# Altium schematic sheet Power_Supply.SchDoc
size A4; SheetNumber: 2; SheetTotal: 6
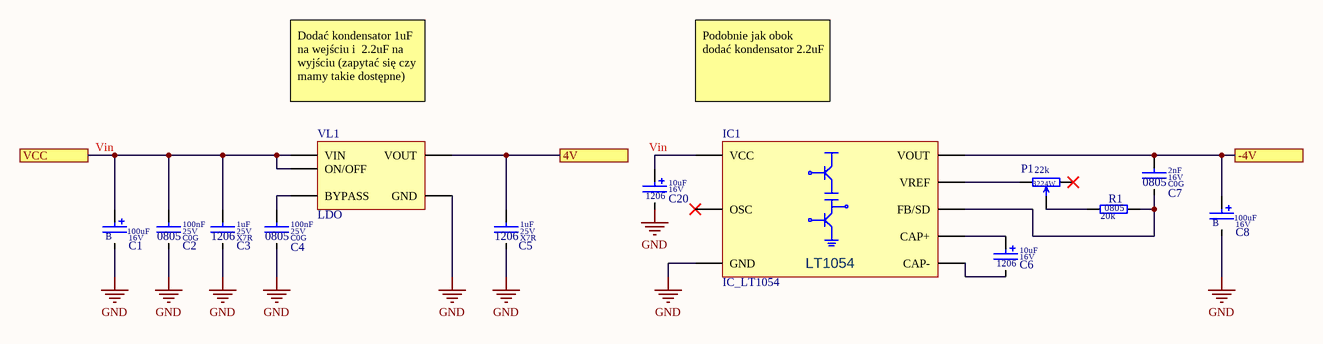
[diagram p0: Power_Supply.SchDoc]

## Parts
C1  value 100uF  SCH_Footprint: B  Voltage: 16V  [CT_B_CASE_BIG]  (hidden comment: CT_Taki_jak_da_Byczek_)
C2  value 100nF  Dielectric: C0G  Voltage: 25V  SCH_Footprint: 0805  [C_0805_2012]  (hidden comment: C_100nF_0805_C0G_25V_5)
C3  value 1uF  Dielectric: X7R  Voltage: 25V  SCH_Footprint: 1206  [C_1206_3216]  (hidden comment: C_1uF_1206_X7R_25V_5)
C4  value 100nF  Dielectric: C0G  Voltage: 25V  SCH_Footprint: 0805  [C_0805_2012]  (hidden comment: C_100nF_0805_C0G_25V_5)
C5  value 1uF  Dielectric: X7R  Voltage: 25V  SCH_Footprint: 1206  [C_1206_3216]  (hidden comment: C_2.2uF_1206_X7R_25V_5)
C6  value 10uF  SCH_Footprint: 1206  Voltage: 16V  [CT_1206_3216]  (hidden comment: CT_10uF_16V_1206_10)
C7  value 2nF  Dielectric: C0G  Voltage: 16V  SCH_Footprint: 0805  [C_0805_2012]  (hidden comment: C_2.2nF_0805_16V_C0G_5)
C8  value 100uF  SCH_Footprint: B  Voltage: 16V  [CT_B_CASE_BIG]  (hidden comment: CT_Taki_jak_da_Byczek_)
C20  value 10uF  SCH_Footprint: 1206  Voltage: 16V  [CT_1206_3216]  (hidden comment: CT_10uF_16V_1206_10)
IC1  IC_LT1054  [SOIC16]
P1  value 22k  SCH_Footprint: 3224W  [Potentiometer]
R1  SCH_Footprint: 0805  Resistance: 20k  [R_0805_2012]  (hidden comment: R_20k_0805_5)
VL1  LDO  [SOT23-5]

## Ports
4V, -4V, VCC

## Nets
GND: C1.2 C2.2 C3.2 C4.2 C5.2 C8.2 C20.2 IC1.5(GND) VL1.2(GND)
4V: C5.1 VL1.5(VOUT) ; port 4V
-4V: C7.1 C8.1 IC1.11(VOUT) ; port -4V
Vin: C1.1 C2.1 C3.1 C20.1 IC1.14(VCC) VL1.1(VIN) VL1.3(ON/OFF) ; port VCC
NetC4_1: C4.1 VL1.4(BYPASS)
NetC6_1: C6.1 IC1.4(CAP+)
NetC6_2: C6.2 IC1.6(CAP-)
NetC7_2: C7.2 IC1.3(FB/SD) R1.2
NetIC1_12: IC1.12(VREF) P1.3
NetP1_2: P1.2 R1.1

Not connected (* = marked no-connect by the designer): IC1 13(OSC)*; P1 1*

## Notes on the sheet
- Dodać kondensator 1uF na wejściu i  2.2uF na wyjściu (zapytać się czy mamy takie dostępne)
- Podobnie jak obok dodać kondensator 2.2uF
- (in symbol IC_LT1054) LT1054

## Library data of the parts
C1 C8 = CT_Taki_jak_da_Byczek_: Capacitor
C2 C4 = C_100nF_0805_C0G_25V_5: Capacitor
C3 = C_1uF_1206_X7R_25V_5: Capacitor
C5 = C_2.2uF_1206_X7R_25V_5: Capacitor
C6 C20 = CT_10uF_16V_1206_10: Capacitor
C7 = C_2.2nF_0805_16V_C0G_5: Capacitor
P1 = R
R1 = R_20k_0805_5: Tolerance: 5
VL1 = VL_LP2985IM5-4.0: Vout: 4V; Vin min: 2.5V; Vin max: 16V; Iout: 150mA; Vdrop: 250mV